# EAGLE design roomba_main_pcb_v1 (EAGLE 9.5.2)
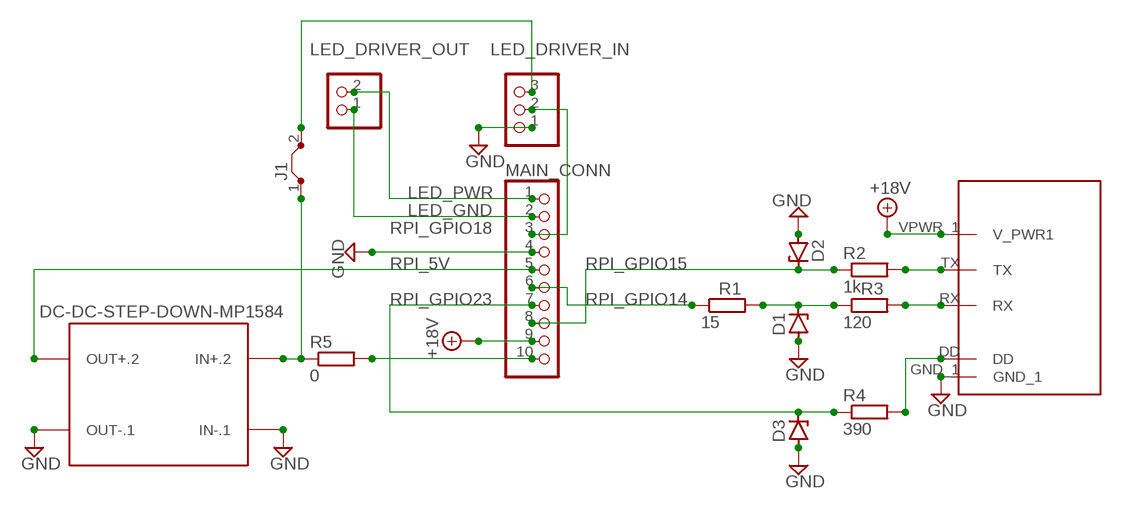
[diagram p0: schematic, sheet 1]

## Parts
D1  ZENER-DIODESOD80C  [SOD80C]
D2  ZENER-DIODESOD80C  [SOD80C]
D3  ZENER-DIODESOD80C  [SOD80C]
J1  J25MM  [25]
LED_DRIVER_IN  PINHD-1X3  [1X03]
LED_DRIVER_OUT  PINHD-1X2  [1X02]
MAIN_CONN  PINHD-1X10/90  [1X10/90]
R1  15  R-EU_M1206  [M1206]
R2  1k  R-EU_M1206  [M1206]
R3  120  R-EU_M1206  [M1206]
R4  390  R-EU_M1206  [M1206]
R5  0  R-EU_M1206  [M1206]
ROOMBA_PORT  7_PIN  [PIN-7]
U$1  DC-DC-STEP-DOWN-MP1584  [DC-DC-STEP-DOWN-MP1584]

## Nets
+18V: MAIN_CONN.9 ROOMBA_PORT.VPWR_1(V_PWR1)
GND: D1.A D2.A D3.A LED_DRIVER_IN.1 MAIN_CONN.4 ROOMBA_PORT.GND_1 U$1.IN-.1 U$1.OUT-.1
LED_GND: LED_DRIVER_OUT.1 MAIN_CONN.2
LED_PWR: LED_DRIVER_OUT.2 MAIN_CONN.1
N$4: J1.1 R5.1 U$1.IN+.2
N$5: R4.2 ROOMBA_PORT.DD
N$6: J1.2 LED_DRIVER_IN.3
N$7: R3.2 ROOMBA_PORT.RX
N$8: D1.C R1.2 R3.1
N$9: R2.2 ROOMBA_PORT.TX
N$11: MAIN_CONN.10 R5.2
RPI_5V: MAIN_CONN.5 U$1.OUT+.2
RPI_GPIO14: MAIN_CONN.6 R1.1
RPI_GPIO15: D2.C MAIN_CONN.8 R2.1
RPI_GPIO18: LED_DRIVER_IN.2 MAIN_CONN.3
RPI_GPIO23: D3.C MAIN_CONN.7 R4.1

## Library data of the parts
D1-D3 = diode:ZENER-DIODE: Z-Diode
J1 = jumper:J: Bridge
LED_DRIVER_IN = pinhead:PINHD-1X3: PIN HEADER
LED_DRIVER_OUT = pinhead:PINHD-1X2: PIN HEADER
MAIN_CONN = pinhead:PINHD-1X10: PIN HEADER
R1-R5 = rcl:R-EU_: RESISTOR, European symbol; SPICEPREFIX: R
ROOMBA_PORT = M_wifi:7_PIN
U$1 = diy-modules:DC-DC-STEP-DOWN-MP1584: DC/DC Step-Down Regulator based on MP1584 chip MP1584 datasheet available here: http://www.haoyuelectronics.com/Attachment/MP1584/MP1584.pdf Click here to find device on ebay.com <http://www.ebay.com/sch/mp1584+module>

## Board
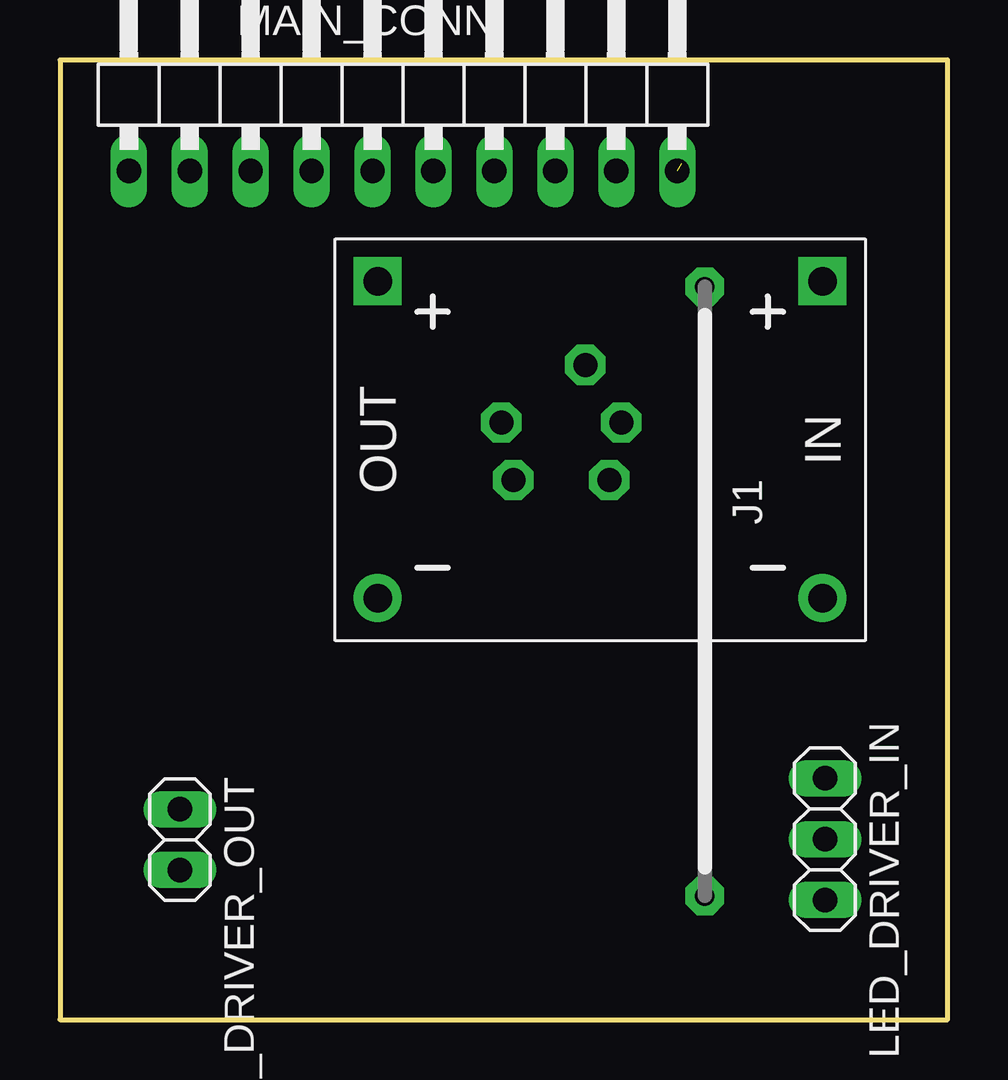
[diagram p1: board, top side]
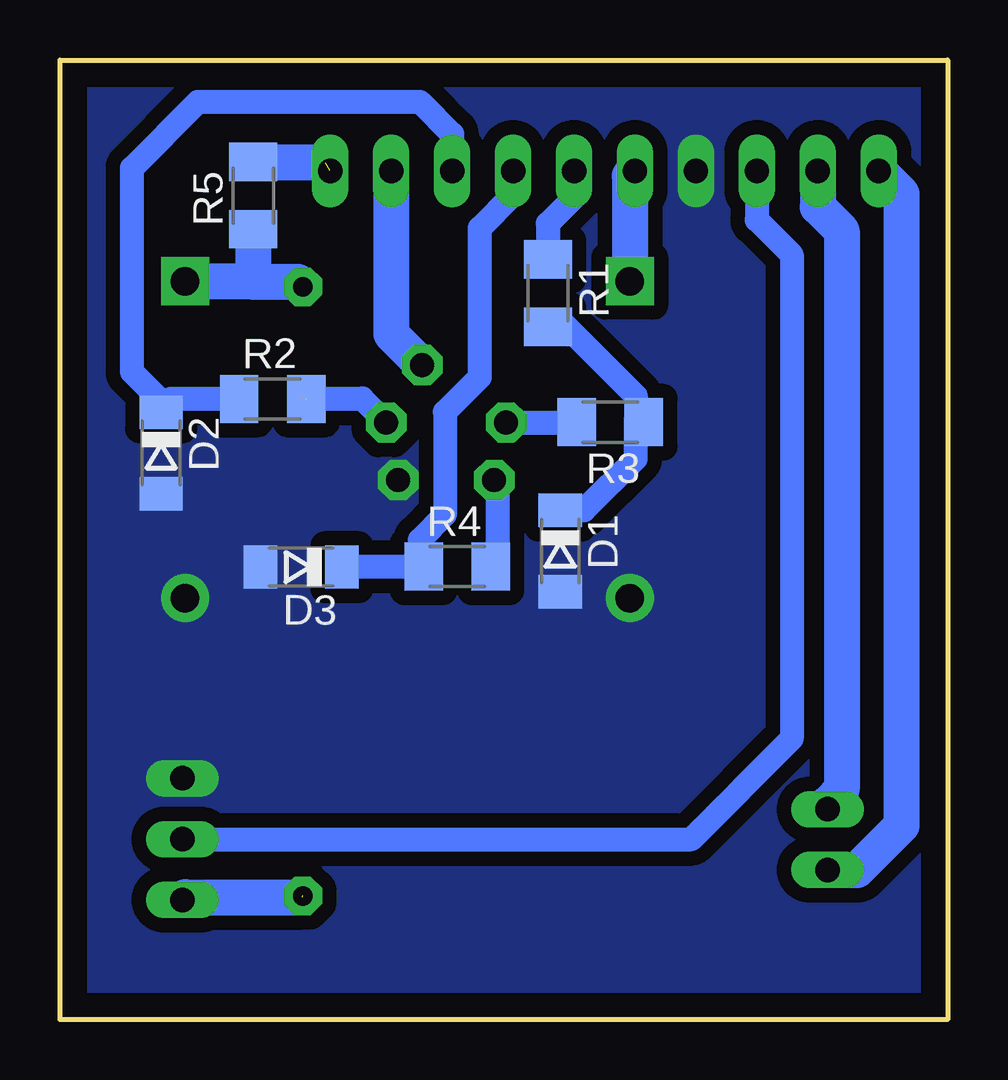
[diagram p2: board, bottom side, seen from below]

Size 37 x 40 mm. Coordinates in mm from the lower left corner, seen from the top.
Outline: 0,0 37,0 37,40 0,40 0,0
Copper layers (1*16): Top 0.035mm / dielectric 1.5mm / Bottom 0.035mm
Design rules "default": minimum track width 10mil, minimum drill 24mil, track to track 8mil, track to pad 8mil, pad to pad 8mil, via to via 8mil, smd to smd 8mil, copper to edge 40mil, drill to drill 8mil, minimum pad ring 10mil, minimum via ring 8mil, stop-mask expansion 4mil, vias tented up to drill 0mil, thermal gap 10mil

### Footprints (pad centres in the part's own frame; a part is rotated, then mirrored left to right if it is on the bottom)
SOD80C = smd 1.4 x 1.8: A 1.7,0; C -1.7,0
25 = drill 0.813 pad 1.6 octagon: 1 -12.7,0; 2 12.7,0
1X03 = drill 1.016 long: 1 -2.54,0; 2 0,0; 3 2.54,0
1X02 = drill 1.016 long: 1 -1.27,0; 2 1.27,0
1X10/90 = drill 1.016 long: 1 -11.43,-3.81; 2 -8.89,-3.81; 3 -6.35,-3.81; 4 -3.81,-3.81; 5 -1.27,-3.81; 6 1.27,-3.81; 7 3.81,-3.81; 8 6.35,-3.81; 9 8.89,-3.81; 10 11.43,-3.81
M1206 = smd 1.6 x 2: 1 -1.4,0; 2 1.4,0
PIN-7 = drill 1 pad 1.676 octagon: DD 2,1.9; GND_1 -2,1.9; RX 2.5,-0.5; TX -2.5,-0.5; VPWR_1 -1,-2.9
DC-DC-STEP-DOWN-MP1584 = drill 1.2 pad 2 square: IN+.2 -9.271,-6.604; OUT+.2 9.271,-6.604 | drill 1.2 pad 2: IN-.1 -9.271,6.604; OUT-.1 9.271,6.604

### Placement (x,y rotation side)
D1  16.15,19.53 270 bottom
D2  32.78,23.62 270 bottom
D3  26.95,18.86 180 bottom
J1  26.88,17.85 270 top
LED_DRIVER_IN  31.89,7.52 270 top
LED_DRIVER_OUT  5,7.5 270 top
MAIN_CONN  14.3,39.19 0 top
R1  16.66,30.28 270 bottom
R2  28.13,25.87 0 bottom
R3  14.06,24.9 180 bottom
R4  20.44,18.88 0 bottom
R5  28.94,34.35 90 bottom
ROOMBA_PORT  20.9,24.39 180 top
U$1  22.52,24.17 180 top

### Tracks (layer width: path | path; a pad name or v marks a point on that pad's centre or on a via)
+18V
  Bottom 1.5: MAIN_CONN.9 23.19,28.58 ROOMBA_PORT.VPWR_1
GND
  pour Bottom (isolate 0.6, no thermals): 37.8,41.69 -3.7,41.69 -3.7,-1.81 37.8,-1.81
LED_GND
  Bottom 1.5: MAIN_CONN.2 5.41,33.88 4.41,32.88 4.41,9.59 5,9 LED_DRIVER_OUT.1
LED_PWR
  Bottom 1.5: MAIN_CONN.1 1.91,34.42 1.91,8.09 3.77,6.23 LED_DRIVER_OUT.2
N$4
  Bottom 1.5: U$1.IN+.2 28.94,30.77 R5.1 28.94,30.76 27.09,30.76 J1.1
N$5
  Bottom 0.254: 18.77,18.67 R4.2
  Bottom 1: ROOMBA_PORT.DD 18.77,22.36 18.77,18.67
N$6  (1 unrouted)
  Bottom 1.5: 26.93,5.1 31.77,5.1 LED_DRIVER_IN.3
N$7
  Bottom 0.254: 16,25.16 16.07,25.13 R3.2 15.1,25.1
  Bottom 1: R3.2 ROOMBA_PORT.RX
N$8
  Bottom 0.254: 16.15,21.81 D1.C | 13,25 12.7,25 R3.1
  Bottom 1: R1.2 16.54,29 16,29 13,26 13,25 13,23.38 15.15,21.23 D1.C
N$9  (1 unrouted)
  Bottom 1: 26.9,25.89 24.4,25.89 ROOMBA_PORT.TX
N$11  (1 unrouted)
  Bottom 1.5: R5.2 25.98,35.75 25.92,35.69
RPI_5V
  Bottom 1.5: MAIN_CONN.5 13.25,35.16 U$1.OUT+.2
RPI_GPIO14
  Bottom 1: MAIN_CONN.6 15.57,34.27 16.66,33.18 R1.1
RPI_GPIO15
  Bottom 1: MAIN_CONN.8 20.65,36.91 22,38.26 31.24,38.26 34,35.5 34,27 32.78,25.78 D2.C 32.3,25.8 32.37,25.87 R2.1
RPI_GPIO18
  Bottom 1: LED_DRIVER_IN.2 10.68,7.52 6.49,11.71 6.49,31.88 7.95,33.34 MAIN_CONN.3
RPI_GPIO23
  Bottom 1: D3.C 25.23,18.88 R4.1 22,19.04 22,20 20.95,21.05 20.95,25.33 19.5,26.78 19.5,32.99 18.11,34.38 MAIN_CONN.7